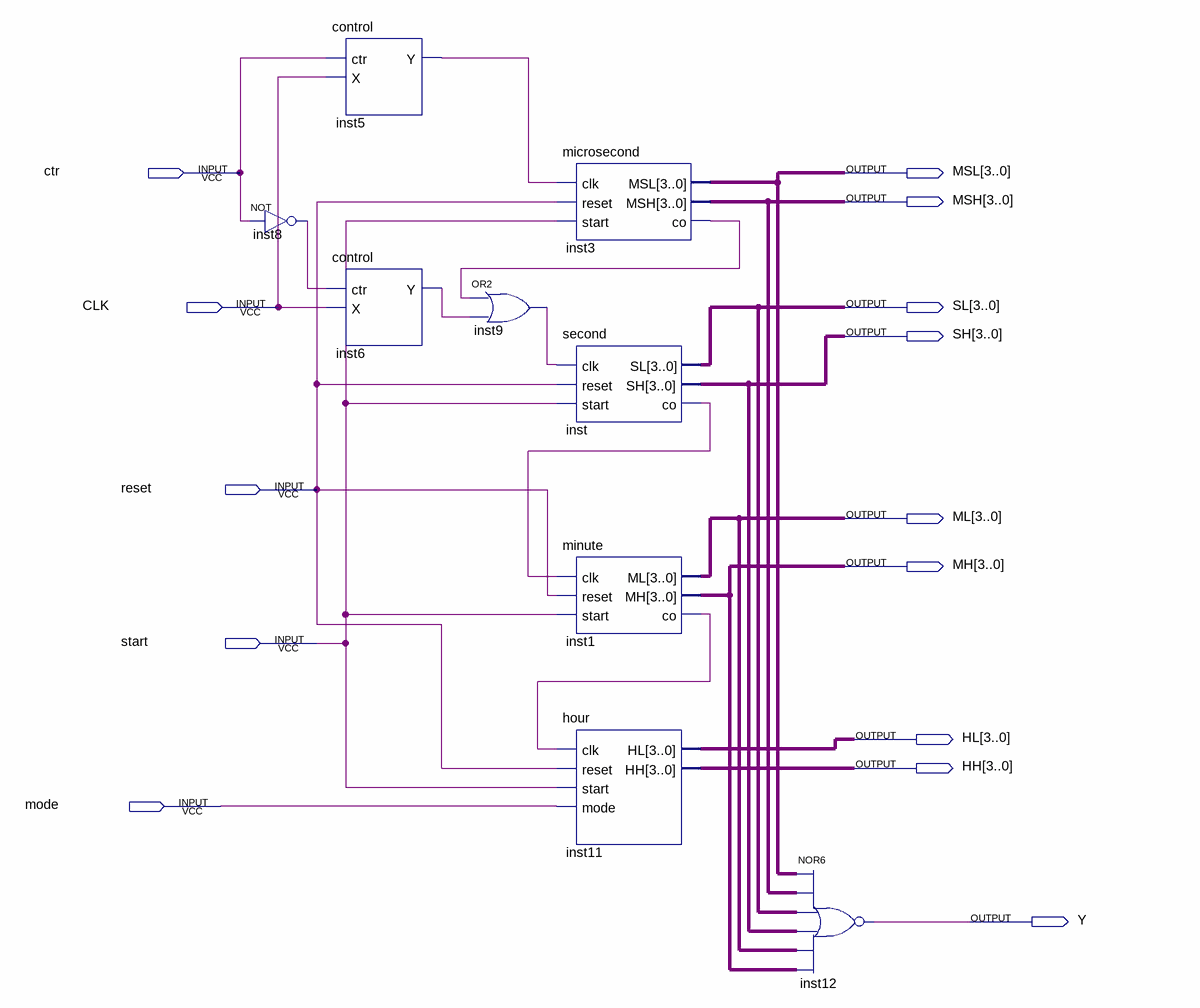
[diagram p0: schematic sheet]
// Quartus schematic Number_Clock.bdf as structural Verilog: 9 symbols, 14 pins
module Number_Clock (
  input  ctr,
  input  CLK,
  input  reset,
  input  start,
  input  mode,
  output [3:0] MSL,
  output [3:0] MSH,
  output [3:0] SL,
  output [3:0] SH,
  output [3:0] ML,
  output [3:0] MH,
  output [3:0] HL,
  output [3:0] HH,
  output Y
);

  wire inst1_co, inst3_co, inst5_y, inst6_y, inst8_out, inst9_out, inst_co;

  not inst8 (inst8_out, ctr);
  control inst5 (.ctr(ctr), .X(CLK), .Y(inst5_y));
  control inst6 (.ctr(inst8_out), .X(CLK), .Y(inst6_y));
  or inst9 (inst9_out, inst3_co, inst6_y);
  microsecond inst3 (.clk(inst5_y), .reset(reset), .start(start), .MSL(MSL), .MSH(MSH), .co(inst3_co));
  second inst (.clk(inst9_out), .reset(reset), .start(start), .SL(SL), .SH(SH), .co(inst_co));
  minute inst1 (.clk(inst_co), .reset(reset), .start(start), .ML(ML), .MH(MH), .co(inst1_co));
  hour inst11 (.clk(inst1_co), .reset(reset), .start(start), .mode(mode), .HL(HL), .HH(HH));
  assign Y = ~(MSL | MSH | SL | SH | ML | MH);  // NOR6 inst12, 4 bits wide
endmodule
